# Altium schematic sheet Э3.SchDoc
size 594 x 420 mm; CheckedBy: Шилкин Д. А.; Author: Шестаков А. А.
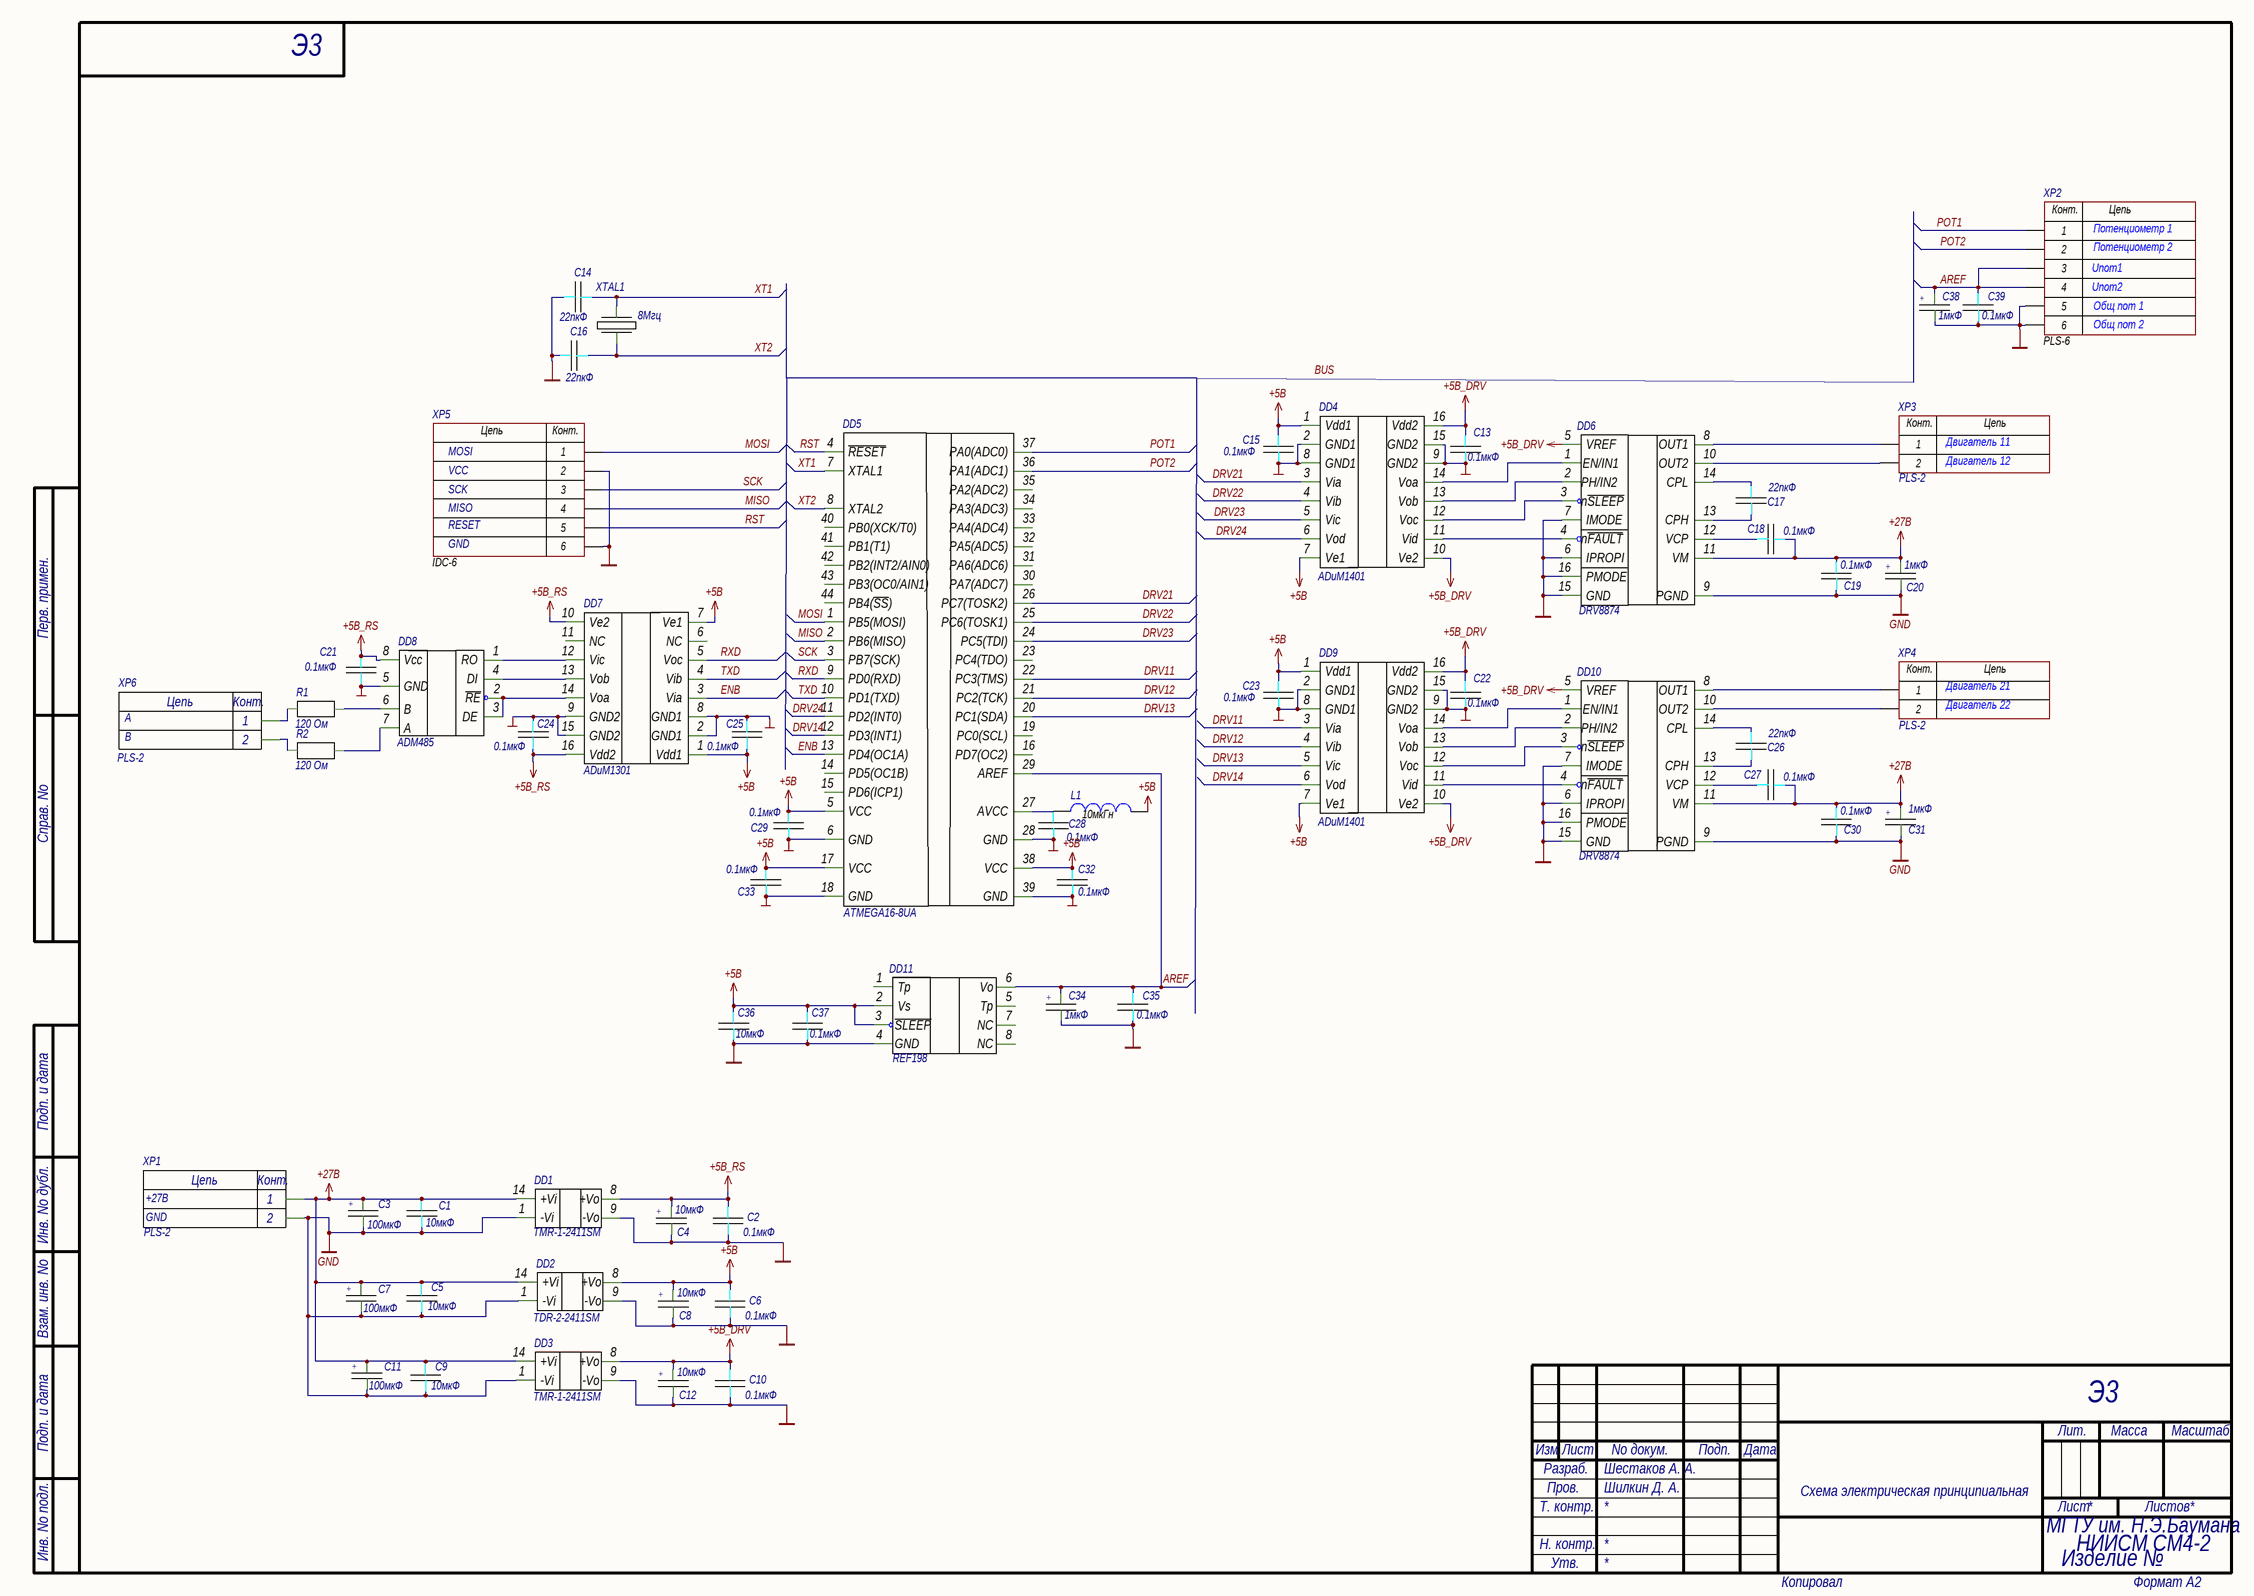
[diagram p0: Э3.SchDoc]

## Parts
C1  10мкФ  [Capacitor_0805]
C2  0.1мкФ  [Capacitor_0805]
C3  100мкФ  [CAPAE4643X46M]
C4  10мкФ  [Capacitor_tant_0805]
C5  10мкФ  [Capacitor_0805]
C6  0.1мкФ  [Capacitor_0805]
C7  100мкФ  [CAPAE4643X46M]
C8  10мкФ  [Capacitor_tant_0805]
C9  10мкФ  [Capacitor_0805]
C10  0.1мкФ  [Capacitor_0805]
C11  100мкФ  [CAPAE4643X46M]
C12  10мкФ  [Capacitor_tant_0805]
C13  0.1мкФ  [Capacitor_0805]
C14  22пкФ  [Capacitor_0805]
C15  0.1мкФ  [Capacitor_0805]
C16  22пкФ  [Capacitor_0805]
C17  22пкФ  [Capacitor_0805]
C18  0.1мкФ  [Capacitor_0805]
C19  0.1мкФ  [Capacitor_0805]
C20  1мкФ  [Capacitor_tant_0805]
C21  0.1мкФ  [Capacitor_0805]
C22  0.1мкФ  [Capacitor_0805]
C23  0.1мкФ  [Capacitor_0805]
C24  0.1мкФ  [Capacitor_0805]
C25  0.1мкФ  [Capacitor_0805]
C26  22пкФ  [Capacitor_0805]
C27  0.1мкФ  [Capacitor_0805]
C28  0.1мкФ  [Capacitor_0805]
C29  0.1мкФ  [Capacitor_0805]
C30  0.1мкФ  [Capacitor_0805]
C31  1мкФ  [Capacitor_tant_0805]
C32  0.1мкФ  [Capacitor_0805]
C33  0.1мкФ  [Capacitor_0805]
C34  1мкФ  [Capacitor_tant_0805]
C35  0.1мкФ  [Capacitor_0805]
C36  10мкФ  [Capacitor_0805]
C37  0.1мкФ  [Capacitor_0805]
C38  1мкФ  [Capacitor_tant_0805]
C39  0.1мкФ  [Capacitor_0805]
DD1  TMR-1-2411SM  [TMR1SM_SMD]
DD2  TDR-2-2411SM  [TMR1SM_SMD]
DD3  TMR-1-2411SM  [TMR1SM_SMD]
DD4  ADuM1401  [ADUM_SOIC]
DD5  ATMEGA16-8UA  [ATMEGA16-44A]
DD6  DRV8874  [DRV8874_TSOP127P600-8N]
DD7  ADuM1301  [ADUM_SOIC]
DD8  ADM485  [SOIC_N8 (REF198, ADM485)]
DD9  ADuM1401  [ADUM_SOIC]
DD10  DRV8874  [DRV8874_TSOP127P600-8N]
DD11  REF198  [SOIC_N8 (REF198, ADM485)]
L1  value 10мкГн  [IND: 0805]
R1  120 Ом  [resistor_0805]
R2  120 Ом  [resistor_0805]
XP1  PLS-2  [CON: PLS-2]
XP2  (no value)  [CON: PLS-6]
XP3  PLS-2  [CON: PLS-2]
XP4  PLS-2  [CON: PLS-2]
XP5  (no value)  [CON: IDC-6MS]
XP6  PLS-2  [CON: PLS-2]
XTAL1  8Мгц  [Z_0503]

## Nets
+5B: C6.1 C8.1 C15.1 C23.1 C25.1 C29.1 C32.1 C33.1 C36.1 C37.1 DD2.8(+Vo) DD4.1(Vdd1) DD4.7(Ve1) DD5.5(VCC) DD5.17(VCC) DD5.38(VCC) DD7.1(Vdd1) DD7.7(Ve1) DD9.1(Vdd1) DD9.7(Ve1) DD11.2(Vs) DD11.3(~{SLEEP}) L1.1
+5B_DRV: C10.1 C12.1 C13.1 C22.1 DD3.8(+Vo) DD4.10(Ve2) DD4.16(Vdd2) DD6.5(VREF) DD9.10(Ve2) DD9.16(Vdd2) DD10.5(VREF)
+5B_RS: C2.1 C4.1 C21.2 C24.1 DD1.8(+Vo) DD7.10(Ve2) DD7.16(Vdd2) DD8.8(Vcc)
+5В: C14.2 C16.2
+27B: C1.1 C3.1 C5.1 C7.1 C9.1 C11.1 C18.2 C19.1 C20.1 C27.2 C30.1 C31.1 DD1.14(+Vi) DD2.14(+Vi) DD3.14(+Vi) DD6.11(VM) DD10.11(VM) XP1.1
GND: C1.2 C3.2 C5.2 C7.2 C9.2 C11.2 C19.2 C20.2 C30.2 C31.2 DD1.1(-Vi) DD2.1(-Vi) DD3.1(-Vi) DD6.9(PGND) DD10.9(PGND) XP1.2
Общ: C6.2 C8.2 C15.2 C23.2 C25.2 C28.2 C29.2 C32.2 C33.2 C34.2 C35.2 C36.2 C37.2 C38.2 C39.2 DD2.9(-Vo) DD4.2(GND1) DD4.8(GND1) DD5.6(GND) DD5.18(GND) DD5.28(GND) DD5.39(GND) DD7.2(GND1) DD7.8(GND1) DD9.2(GND1) DD9.8(GND1) DD11.4(GND) XP2.5 XP2.6 XP5.2 XP5.6
Общ_DRV: C10.2 C12.2 C13.2 C22.2 DD3.9(-Vo) DD4.9(GND2) DD4.15(GND2) DD6.6(IPROPI) DD6.7(IMODE) DD6.15(GND) DD6.16(PMODE) DD9.9(GND2) DD9.15(GND2) DD10.6(IPROPI) DD10.7(IMODE) DD10.15(GND) DD10.16(PMODE)
Общ_RS: C2.2 C4.2 C21.1 C24.2 DD1.9(-Vo) DD7.9(GND2) DD7.15(GND2) DD8.5(GND)
AREF: C34.1 C35.1 C38.1 C39.1 DD5.29(AREF) DD11.6(Vo) XP2.3 XP2.4
DRV11: DD5.22(PC3(TMS)) DD9.3(Via)
DRV12: DD5.21(PC2(TCK)) DD9.4(Vib)
DRV13: DD5.20(PC1(SDA)) DD9.5(Vic)
DRV14: DD5.12(PD3(INT1)) DD9.6(Vod)
DRV21: DD4.3(Via) DD5.26(PC7(TOSK2))
DRV22: DD4.4(Vib) DD5.25(PC6(TOSK1))
DRV23: DD4.5(Vic) DD5.24(PC5(TDI))
DRV24: DD4.6(Vod) DD5.11(PD2(INT0))
ENB: DD5.13(PD4(OC1A)) DD7.3(Via)
MISO: DD5.2(PB6(MISO)) XP5.4
MOSI: DD5.1(PB5(MOSI)) XP5.1
POT1: DD5.37(PA0(ADC0)) XP2.1
POT2: DD5.36(PA1(ADC1)) XP2.2
RST: DD5.4(~{RESET}) XP5.5
RXD: DD5.9(PD0(RXD)) DD7.5(Voc)
SCK: DD5.3(PB7(SCK)) XP5.3
TXD: DD5.10(PD1(TXD)) DD7.4(Vib)
XT1: C14.1 DD5.7(XTAL1) XTAL1.2
XT2: C16.1 DD5.8(XTAL2) XTAL1.1
NetC17_1: C17.1 DD6.14(CPL)
NetC17_2: C17.2 DD6.13(CPH)
NetC18_1: C18.1 DD6.12(VCP)
NetC26_1: C26.1 DD10.14(CPL)
NetC26_2: C26.2 DD10.13(CPH)
NetC27_1: C27.1 DD10.12(VCP)
NetC28_1: C28.1 DD5.27(AVCC) L1.2
NetDD4_11: DD4.11(Vid) DD6.4(n~{FAULT})
NetDD4_12: DD4.12(Voc) DD6.3(n~{SLEEP})
NetDD4_13: DD4.13(Vob) DD6.2(PH/IN2)
NetDD4_14: DD4.14(Voa) DD6.1(EN/IN1)
NetDD6_8: DD6.8(OUT1) XP3.1
NetDD6_10: DD6.10(OUT2) XP3.2
NetDD7_12: DD7.12(Vic) DD8.1(RO)
NetDD7_13: DD7.13(Vob) DD8.4(DI)
NetDD7_14: DD7.14(Voa) DD8.2(~{RE}) DD8.3(DE)
NetDD8_6: DD8.6(B) R1.1
NetDD8_7: DD8.7(A) R2.1
NetDD9_11: DD9.11(Vid) DD10.4(n~{FAULT})
NetDD9_12: DD9.12(Voc) DD10.3(n~{SLEEP})
NetDD9_13: DD9.13(Vob) DD10.2(PH/IN2)
NetDD9_14: DD9.14(Voa) DD10.1(EN/IN1)
NetDD10_8: DD10.8(OUT1) XP4.1
NetDD10_10: DD10.10(OUT2) XP4.2
NetR1_0: R1.0 XP6.1
NetR2_0: R2.0 XP6.2

Not connected (* = marked no-connect by the designer): DD5 14(PD5(OC1B)) 15(PD6(ICP1)) 16(PD7(OC2)) 19(PC0(SCL)) 23(PC4(TDO)) 30(PA7(ADC7)) 31(PA6(ADC6)) 32(PA5(ADC5)) 33(PA4(ADC4)) 34(PA3(ADC3)) 35(PA2(ADC2)) 40(PB0(XCK/T0)) 41(PB1(T1)) 42(PB2(INT2/AIN0)) 43(PB3(OC0/AIN1)) 44(PB4(~{SS})); DD7 6(NC) 11(NC); DD11 1(Tp) 5(Tp) 7(NC) 8(NC)

## Notes on the sheet
- Потенциометр 1
- Потенциометр 2
- Uпот1
- Uпот2
- Общ пот 1
- Общ пот 2
- MOSI
- Двигатель 11
- VCC
- SCK
- Двигатель 12
- MISO
- RESET
- GND
- Двигатель 21
- A
- B
- Двигатель 22
- +27В
- Labels drawn without touching a wire or pin: BUS
- Э3
- Перв. примен.
- Справ. No
- Подп. и дата
- Инв. No дубл.
- Взам. инв. No
- Изм.
- Лист
- No докум.
- Подп.
- Дата
- Лит.
- Масса
- Масштаб
- Т. контр.
- Разраб.
- Пров.
- Схема электрическая принципиальная
- Листов
- Инв. No подл.
- Н. контр.
- МГТУ им. Н.Э.Баумана
- НИИСМ СМ4-2
- Утв.
- Копировал
- Изделие №
- Формат А2
- (in symbol Capacity_electrolity_polar_0805) +
- (in symbol Capacity_tantal_0805) +
- (in symbol IDC-6) Цепь; Конт.
- (in symbol PLS-2) Цепь; Конт.
- (in symbol PLS-2-1) Конт.; Цепь
- (in symbol PLS-6) Конт.; Цепь

## Library data of the parts
C1 C2 C5 C6 C9 C10 C13-C19 C21-C30 C32 C33 C35-C37 C39 = Capacity_0805
C3 C7 C11 = Capacity_electrolity_polar_0805: electrolity capacitor; link: https://www.digikey.com/en/products/detail/taiyo-yuden/JMK212BJ106KD-T/930656
C4 C8 C12 C20 C31 C34 C38 = Capacity_tantal_0805: tanral capacitor
DD5 = ATMEGA16-44A
L1 = Inductor_0805: Manufacturer: Murata Electronics; PartNumber: LQM21FN100M70L; ValueManufacturerPartNumber: Fixed inductor, 10мкГн, ±20%, 0805, 100mA, -55...+125°C; TypeInductor: Fixed inductor; MaxCurrent: 100mA; Tolerance: ±20%; Package: 0805; HelpURL: https://www.digikey.com/product-detail/en/murata-electronics-north-america/LQM21FN100M70L/490-4029-1-ND/1016289; Temperature: -55...+125°C
R1 R2 = Resistor_0805
XP1 XP6 = PLS-2: https://www.chipdip.ru/product/wf-2r
XP2 = PLS-6: Manufacturer: Connfly; ValueManufacturerPartNumber: Connector, 6pin, 2.54mm, 500VAC, 3A; TypeConnector: Connector; VoltageMax: 500VAC; Pitch: 2.54mm; CurrentMax: 3A; Multichannel: 6pin; HelpURL: https://www.chipdip.ru/product/pls-6; PartNumber: PLS-6; CommentText: PLS-6
XP3 XP4 = PLS-2-1
XP5 = IDC-6: Manufacturer: Connfly; ValueManufacturerPartNumber: Connector, 6pin, 2.54mm, 500VAC, 3A; PartNumber: PLS-6; TypeConnector: Connector; VoltageMax: 500VAC; Pitch: 2.54mm; CurrentMax: 3A; Multichannel: 6pin; HelpURL: https://www.chipdip.ru/product/pls-6; CommentText: IDC-6
XTAL1 = resonstor